# EAGLE schematic keypad (EAGLE 6.2)
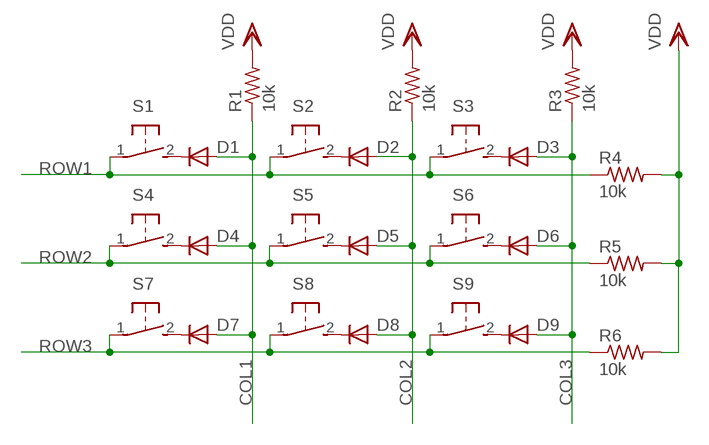
[diagram p0: schematic, sheet 1]

## Parts
D1  1N4148DO35-7  [DO35-7]
D2  1N4148DO35-7  [DO35-7]
D3  1N4148DO35-7  [DO35-7]
D4  1N4148DO35-7  [DO35-7]
D5  1N4148DO35-7  [DO35-7]
D6  1N4148DO35-7  [DO35-7]
D7  1N4148DO35-7  [DO35-7]
D8  1N4148DO35-7  [DO35-7]
D9  1N4148DO35-7  [DO35-7]
R1  10k  R-US_0204/7  [0204/7]
R2  10k  R-US_0204/7  [0204/7]
R3  10k  R-US_0204/7  [0204/7]
R4  10k  R-US_0204/7  [0204/7]
R5  10k  R-US_0204/7  [0204/7]
R6  10k  R-US_0204/7  [0204/7]
S1  31-XX  [B3F-31XX]
S2  31-XX  [B3F-31XX]
S3  31-XX  [B3F-31XX]
S4  31-XX  [B3F-31XX]
S5  31-XX  [B3F-31XX]
S6  31-XX  [B3F-31XX]
S7  31-XX  [B3F-31XX]
S8  31-XX  [B3F-31XX]
S9  31-XX  [B3F-31XX]

## Nets
COL1: D1.A D4.A D7.A R1.1
COL2: D2.A D5.A D8.A R2.1
COL3: D3.A D6.A D9.A R3.1
N$1: D1.C S1.2(S)
N$2: D2.C S2.2(S)
N$3: D3.C S3.2(S)
N$4: D4.C S4.2(S)
N$5: D5.C S5.2(S)
N$6: D6.C S6.2(S)
N$7: D7.C S7.2(S)
N$8: D8.C S8.2(S)
N$9: D9.C S9.2(S)
ROW1: R4.1 S1.1(P) S2.1(P) S3.1(P)
ROW2: R5.1 S4.1(P) S5.1(P) S6.1(P)
ROW3: R6.1 S7.1(P) S8.1(P) S9.1(P)
VDD: R1.2 R2.2 R3.2 R4.2 R6.2
Unconnected: R5.2

## Library data of the parts
D1-D9 = diode:1N4148: DIODE high speed (Philips)
R1-R6 = rcl:R-US_: RESISTOR, American symbol
S1-S9 = switch-omron:31-XX: OMRON SWITCH; MPN: B3F-3100; OC_FARNELL: 959704; OC_NEWARK: 36M3582